# EAGLE design shades_v40 (EAGLE 9.6.2)
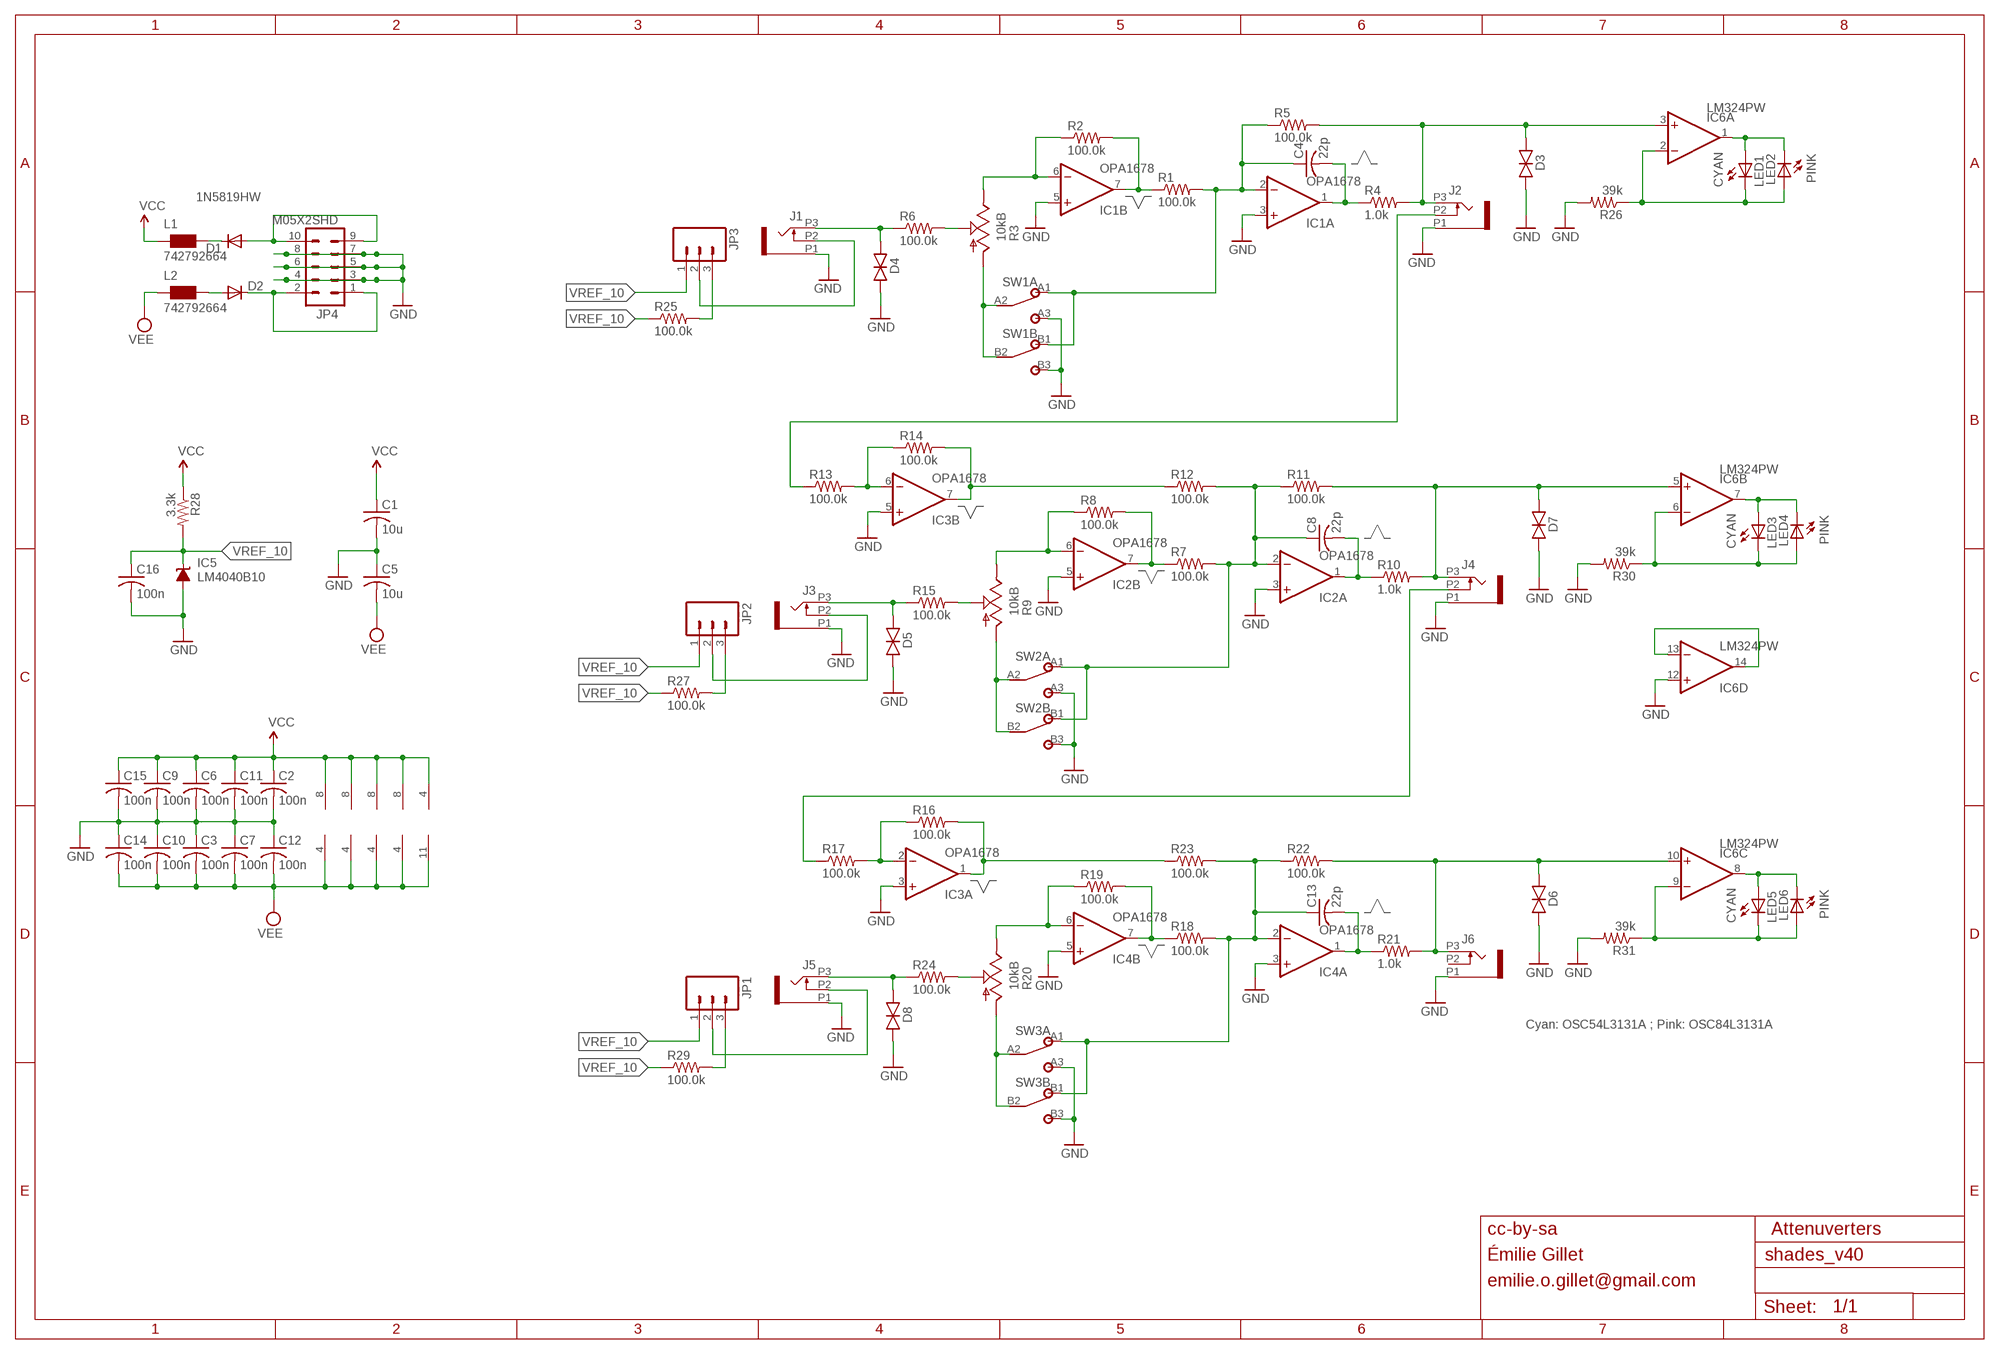
[diagram p0: schematic, sheet 1]

## Parts
C1  10u  C-USC1210  [C1210]
C2  100n  C-USC0402  [C0402]
C3  100n  C-USC0402  [C0402]
C4  22p  C-USC0402  [C0402]
C5  10u  C-USC1210  [C1210]
C6  100n  C-USC0402  [C0402]
C7  100n  C-USC0402  [C0402]
C8  22p  C-USC0402  [C0402]
C9  100n  C-USC0402  [C0402]
C10  100n  C-USC0402  [C0402]
C11  100n  C-USC0402  [C0402]
C12  100n  C-USC0402  [C0402]
C13  22p  C-USC0402  [C0402]
C14  100n  C-USC0402  [C0402]
C15  100n  C-USC0402  [C0402]
C16  100n  C-USC0402  [C0402]
D1  1N5819HW  DIODE-SOD123  [SOD123]
D2  1N5819HW  DIODE-SOD123  [SOD123]
D3  TVS  [0603]
D4  TVS  [0603]
D5  TVS  [0603]
D6  TVS  [0603]
D7  TVS  [0603]
D8  TVS  [0603]
IC1  OPA1678  OPA1678DGK  [VSSOP8]
IC2  OPA1678  OPA1678DGK  [VSSOP8]
IC3  OPA1678  OPA1678DGK  [VSSOP8]
IC4  OPA1678  OPA1678DGK  [VSSOP8]
IC5  LM4040B10  LM4041B12DBZ  [DBZ_R-PDSO-G3]
IC6  LM324PW  TL074PW  [TSSOP14_065]
J1  PJ301_THONKICONNTME  [WQP_PJ_301M_TME]
J2  PJ301_THONKICONNTME  [WQP_PJ_301M_TME]
J3  PJ301_THONKICONNTME  [WQP_PJ_301M_TME]
J4  PJ301_THONKICONNTME  [WQP_PJ_301M_TME]
J5  PJ301_THONKICONNTME  [WQP_PJ_301M_TME]
J6  PJ301_THONKICONNTME  [WQP_PJ_301M_TME]
JP1  M03PTH  [1X03]
JP2  M03PTH  [1X03]
JP3  M03PTH  [1X03]
JP4  M05X2SHD  [2X5-SHROUDED]
L1  742792664  WE-CBF_0603  [0603]
L2  742792664  WE-CBF_0603  [0603]
LED1  CYAN  LED3MM  [LED3MM]
LED2  PINK  LED3MM  [LED3MM]
LED3  CYAN  LED3MM  [LED3MM]
LED4  PINK  LED3MM  [LED3MM]
LED5  CYAN  LED3MM  [LED3MM]
LED6  PINK  LED3MM  [LED3MM]
R1  100.0k  R-US_R0402  [R0402]
R2  100.0k  R-US_R0402  [R0402]
R3  10kB  POT_USVERTICAL_PS  [ALPS_POT_VERTICAL_PS]
R4  1.0k  R-US_R0603  [R0603]
R5  100.0k  R-US_R0402  [R0402]
R6  100.0k  R-US_R0402  [R0402]
R7  100.0k  R-US_R0402  [R0402]
R8  100.0k  R-US_R0402  [R0402]
R9  10kB  POT_USVERTICAL_PS  [ALPS_POT_VERTICAL_PS]
R10  1.0k  R-US_R0603  [R0603]
R11  100.0k  R-US_R0402  [R0402]
R12  100.0k  R-US_R0402  [R0402]
R13  100.0k  R-US_R0402  [R0402]
R14  100.0k  R-US_R0402  [R0402]
R15  100.0k  R-US_R0402  [R0402]
R16  100.0k  R-US_R0402  [R0402]
R17  100.0k  R-US_R0402  [R0402]
R18  100.0k  R-US_R0402  [R0402]
R19  100.0k  R-US_R0402  [R0402]
R20  10kB  POT_USVERTICAL_PS  [ALPS_POT_VERTICAL_PS]
R21  1.0k  R-US_R0603  [R0603]
R22  100.0k  R-US_R0402  [R0402]
R23  100.0k  R-US_R0402  [R0402]
R24  100.0k  R-US_R0402  [R0402]
R25  100.0k  R-US_R0402  [R0402]
R26  39k  R-US_R0402  [R0402]
R27  100.0k  R-US_R0402  [R0402]
R28  3.3k  R-US_R0402  [R0402]
R29  100.0k  R-US_R0402  [R0402]
R30  39k  R-US_R0402  [R0402]
R31  39k  R-US_R0402  [R0402]
SW1  S-ON-ON-ONSS70070F-0202  [SS70070F-0202]
SW2  S-ON-ON-ONSS70070F-0202  [SS70070F-0202]
SW3  S-ON-ON-ONSS70070F-0202  [SS70070F-0202]

## Nets
GND: C1.2 C2.2 C3.1 C5.1 C6.2 C7.1 C9.2 C10.1 C11.2 C12.1 C14.1 C15.2 C16.2 D3.1(A) D4.1(A) D5.1(A) D6.1(A) D7.1(A) D8.1(A) IC1.3(A:+IN) IC1.5(B:+IN) IC2.3(A:+IN) IC2.5(B:+IN) IC3.3(A:+IN) IC3.5(B:+IN) IC4.3(A:+IN) IC4.5(B:+IN) IC5.2(A) IC6.12(D:+IN) J1.P1 J2.P1 J3.P1 J4.P1 J5.P1 J6.P1 JP4.3 JP4.4 JP4.5 JP4.6 JP4.7 JP4.8 R26.2 R30.2 R31.2 SW1.A3 SW1.B3 SW2.A3 SW2.B3 SW3.A3 SW3.B3
N$2: D1.A JP4.9 JP4.10
N$4: IC6.2(A:-IN) LED1.K(C) LED2.A R26.1
N$5: IC6.13(D:-IN) IC6.14(D:OUT)
N$6: IC6.6(B:-IN) LED3.K(C) LED4.A R30.1
N$7: IC6.1(A:OUT) LED1.A LED2.K(C)
N$8: J1.P2 JP3.2
N$9: J3.P2 JP2.2
N$10: R3.P$2(S) R6.2
N$11: R3.P$3(A) SW1.A2 SW1.B2
N$12: C4.1 IC1.2(A:-IN) R1.2 R5.1 SW1.A1 SW1.B1
N$13: IC1.6(B:-IN) R2.1 R3.P$1(E)
N$14: IC1.7(B:OUT) R1.1 R2.2
N$15: C4.2 IC1.1(A:OUT) R4.1
N$16: JP3.3 R25.2
N$17: JP2.3 R27.2
N$18: R9.P$2(S) R15.2
N$19: R9.P$3(A) SW2.A2 SW2.B2
N$20: IC6.7(B:OUT) LED3.A LED4.K(C)
N$21: D2.C JP4.1 JP4.2
N$22: IC2.6(B:-IN) R8.1 R9.P$1(E)
N$23: IC2.7(B:OUT) R7.1 R8.2
N$24: IC6.9(C:-IN) LED5.K(C) LED6.A R31.1
N$25: C8.2 IC2.1(A:OUT) R10.1
N$26: J5.P2 JP1.2
N$27: R20.P$2(S) R24.2
N$28: IC6.8(C:OUT) LED5.A LED6.K(C)
N$29: JP1.3 R29.2
N$30: IC4.6(B:-IN) R19.1 R20.P$1(E)
N$31: IC4.7(B:OUT) R18.1 R19.2
N$33: C13.2 IC4.1(A:OUT) R21.1
N$36: IC3.6(B:-IN) R13.2 R14.1
N$37: IC3.2(A:-IN) R16.1 R17.2
N$38: IC3.1(A:OUT) R16.2 R23.1
N$39: IC3.7(B:OUT) R12.1 R14.2
N$40: C13.1 IC4.2(A:-IN) R18.2 R22.1 R23.2 SW3.A1 SW3.B1
N$41: C8.1 IC2.2(A:-IN) R7.2 R11.1 R12.2 SW2.A1 SW2.B1
N$48: D1.C L1.2
N$50: D2.A L2.2
OUT_1: D3.2(C) IC6.3(A:+IN) J2.P3 R4.2 R5.2
OUT_2: D7.2(C) IC6.5(B:+IN) J4.P3 R10.2 R11.2
OUT_3: D6.2(C) IC6.10(C:+IN) J6.P3 R21.2 R22.2
RAW_IN_1: D4.2(C) J1.P3 R6.1
RAW_IN_2: D5.2(C) J3.P3 R15.1
RAW_IN_3: D8.2(C) J5.P3 R24.1
SEND_1: J2.P2 R13.1
SEND_2: J4.P2 R17.1
SW3: R20.P$3(A) SW3.A2 SW3.B2
VCC: C1.1 C2.1 C6.1 C9.1 C11.1 C15.1 IC1.8(P:V+) IC2.8(P:V+) IC3.8(P:V+) IC4.8(P:V+) IC6.4(P:V+) L1.1 R28.1
VEE: C3.2 C5.2 C7.2 C10.2 C12.2 C14.2 IC1.4(P:V-) IC2.4(P:V-) IC3.4(P:V-) IC4.4(P:V-) IC6.11(P:V-) L2.1
VREF_10: C16.1 IC5.1(C) JP1.1 JP2.1 JP3.1 R25.1 R27.1 R28.2 R29.1
Unconnected: J6.P2

## Notes on the sheet
- Cyan: OSC54L3131A ; Pink: OSC84L3131A
- cc-by-sa | Attenuverters
- Émilie Gillet
- emilie.o.gillet@gmail.com

## Library data of the parts
C1-C16 = rcl:C-US: CAPACITOR, American symbol
D1 D2 = diode:DIODE-: DIODE
D3-D8 = og-diodes:TVS
IC1-IC4 = og-linear:OPA1678
IC5 = texas:LM4041: PRECISION MICROPOWER SHUNT VOLTAGE REFERENCE Source: http://focus.ti.com/lit/ds/slcs146e/slcs146e.pdf
IC6 = og-linear:TL074: OP AMP
J1-J6 = og-pj301:PJ301_THONKICONN
JP1-JP3 = SparkFun:M03: Header 3 Standard 3-pin 0.1" header. Use with straight break away headers (SKU : PRT-00116), right angle break away headers (PRT-00553), swiss pins (PRT-00743), machine pins (PRT-00117), and female headers (PRT-00115). Molex polarized connector foot print use with SKU : PRT-08232 with associated crimp pins and housings.
JP4 = og-header:M05X2: Header 5x2 Standard 10-pin dual row 0.1" header. Commonly used with AVR-ISP. Use with Spark Fun Electronics SKU: PRT-00778
L1 L2 = wuerth-elektronik:WE-CBF: SMD EMI Suppression Ferrite Beads - excellent anti-EMI properties - low DCR - impedances till 3000 ohms - rated current up to 6 A
LED1-LED6 = led:LED: LED OSRAM: - CHIPLED LG R971, LG N971, LY N971, LG Q971, LY Q971, LO R971, LY R971 LH N974, LH R974 LS Q976, LO Q976, LY Q976 LO Q996 - Hyper CHIPLED LW Q18S LB Q993, LB Q99A, LB R99A - SideLED LS A670, LO A670, LY A670, LG A670, LP A670 LB A673, LV A673, LT A673, LW A673 LH A674 LY A675 LS A676, LA A676, LO A676, LY A676, LW A676 LS A679, LY A679, LG A679 - Hyper Micro SIDELED® LS Y876, LA Y876, LO Y876, LY Y876 LT Y87S - SmartLED LW L88C, LW L88S LB L89C, LB L89S, LG L890 LS L89K, LO L89K, LY L89K LS L896, LA L896, LO L896, LY L896 - TOPLED LS T670, LO T670, LY T670, LG T670, LP T670 LSG T670, LSP T670, LSY T670, LOP T670, LYG T670 LG T671, LOG T671, LSG T671 LB T673, LV T673, LT T673, LW T673 LH T674 LS T676, LA T676, LO T676, LY T676, LB T676, LH T676, LSB T676, LW T676 LB T67C, LV T67C, LT T67C, LS T67K, LO T67K, LY T67K, LW E67C LS E67B, LA E67B, LO E67B, LY E67B, LB E67C, LV E67C, LT E67C LW T67C LS T679, LY T679, LG T679 LS T770, LO T770, LY T770, LG T770, LP T770 LB T773, LV T773, LT T773, LW T773 LH T774 LS E675, LA E675, LY E675, LS T675 LS T776, LA T776, LO T776, LY T776, LB T776 LHGB T686 LT T68C, LB T68C - Hyper Mini TOPLED® LB M676 - Mini TOPLED Santana® LG M470 LS M47K, LO M47K, LY M47K Source: http://www.osram.convergy.de LUXEON: - LUMILED® LXK2-PW12-R00, LXK2-PW12-S00, LXK2-PW14-U00, LXK2-PW14-V00 LXK2-PM12-R00, LXK2-PM12-S00, LXK2-PM14-U00 LXK2-PE12-Q00, LXK2-PE12-R00, LXK2-PE12-S00, LXK2-PE14-T00, LXK2-PE14-U00 LXK2-PB12-K00, LXK2-PB12-L00, LXK2-PB12-M00, LXK2-PB14-N00, LXK2-PB14-P00, LXK2-PB14-Q00 LXK2-PR12-L00, LXK2-PR12-M00, LXK2-PR14-Q00, LXK2-PR14-R00 LXK2-PD12-Q00, LXK2-PD12-R00, LXK2-PD12-S00 LXK2-PH12-R00, LXK2-PH12-S00 LXK2-PL12-P00, LXK2-PL12-Q00, LXK2-PL12-R00 Source: www.luxeon.com KINGBRIGHT: KA-3528ASYC Source: www.kingbright.com
R1 R2 R4-R8 R10-R19 R21-R27 R29-R31 = rcl:R-US_: RESISTOR, American symbol
R3 R9 R20 = pot-alps:POT_US
R28 = resistor:R-US_: RESISTOR, American symbol
SW1-SW3 = og-switch:S-ON-ON-ON

## Board
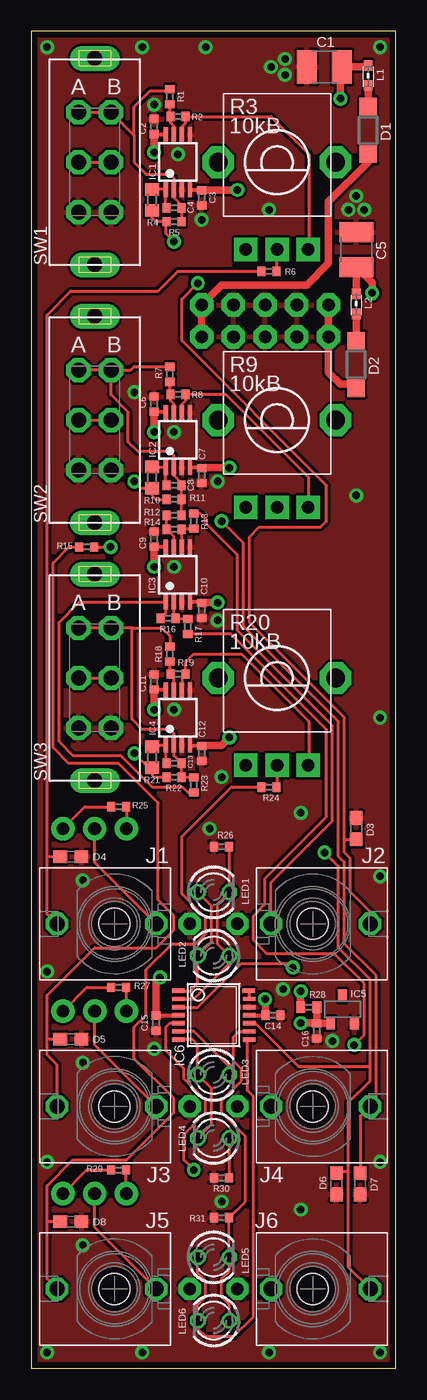
[diagram p1: board, top side]
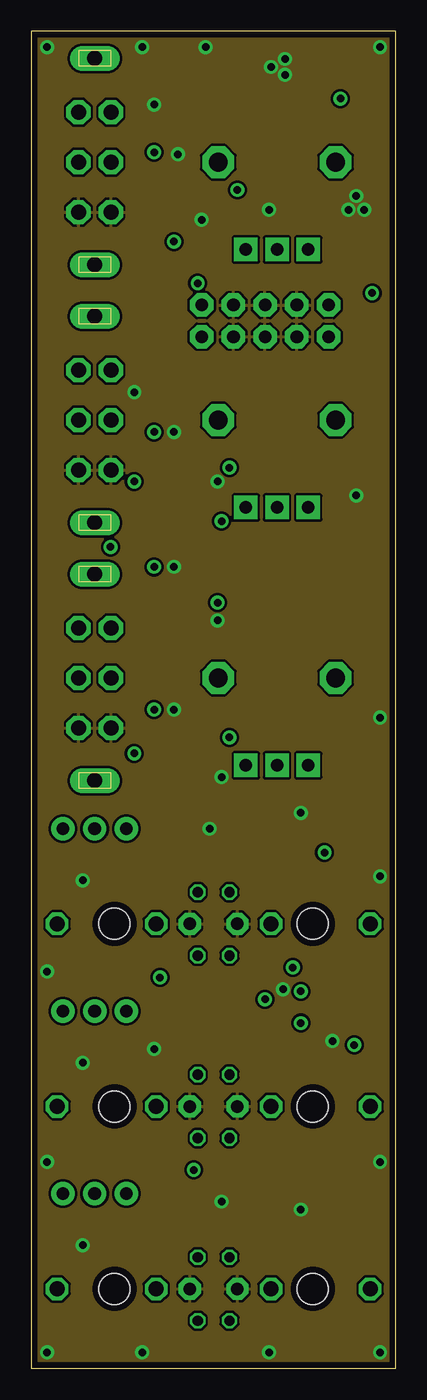
[diagram p2: board, inner layer InternalGround]
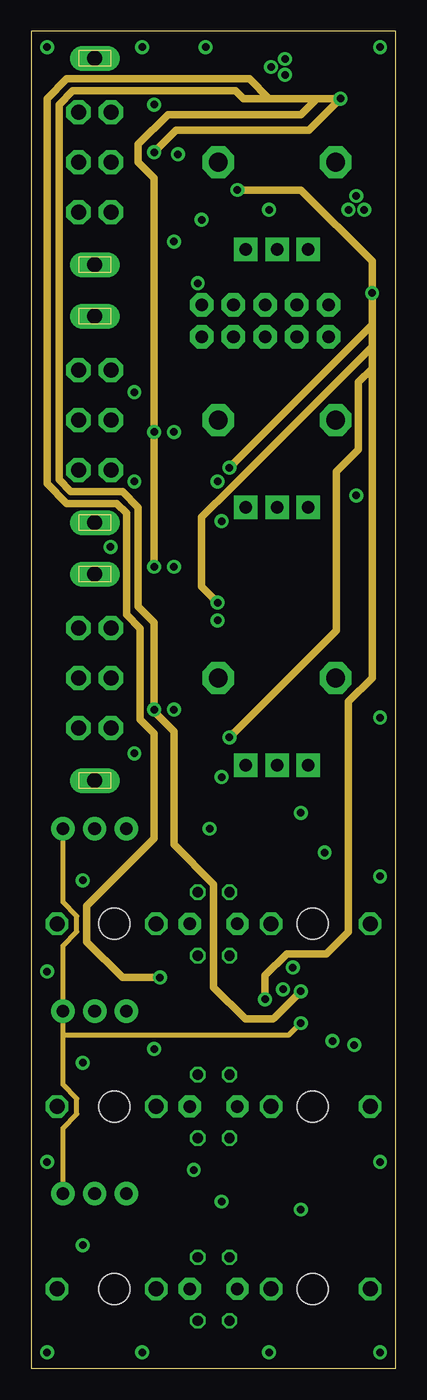
[diagram p3: board, inner layer Supplies]
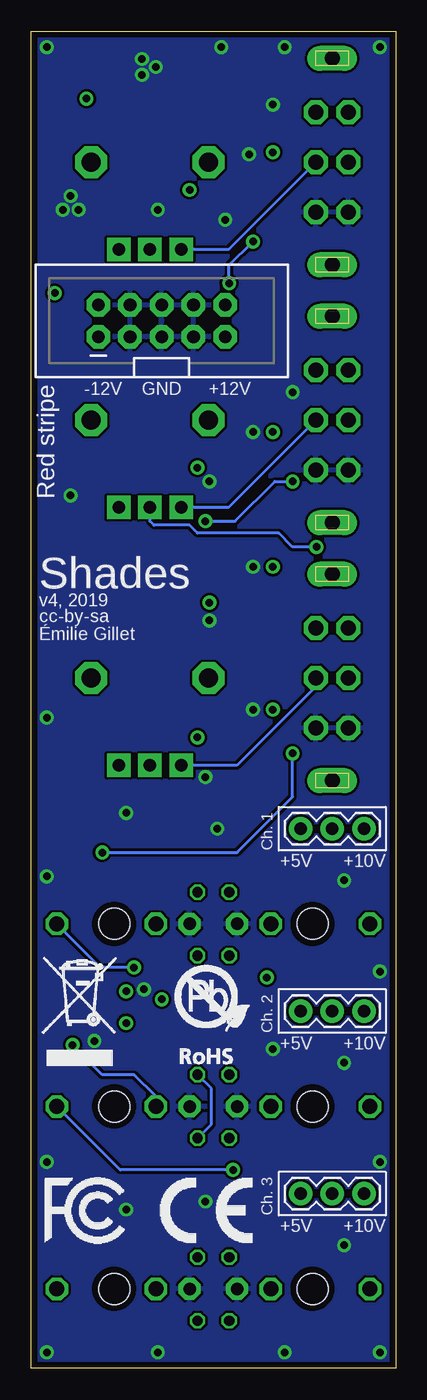
[diagram p4: board, bottom side, seen from below]

Size 29.19 x 107 mm. Coordinates in mm from the lower left corner, seen from the top.
Outline: 0,0 29.19,0 29.19,107 0,107 0,0
Copper layers (1+2*15+16): Top 0.05mm / dielectric 0.3mm / InternalGround 0.05mm / dielectric 0.75mm / Supplies 0.035mm / dielectric 0.2mm / Bottom 0.05mm
Design rules "PCBCart-Standard-4L": minimum track width 8mil, minimum drill 0.3mm, track to track 8mil, track to pad 8mil, pad to pad 8mil, via to via 8mil, smd to smd 8mil, copper to edge 20mil, drill to drill 8mil, minimum pad ring 8mil, minimum via ring 10mil, stop-mask expansion 3mil, vias tented up to drill 25mil, thermal gap 8mil

### Footprints (pad centres in the part's own frame; a part is rotated, then mirrored left to right if it is on the bottom)
C1210 = smd 1.6 x 2.7: 1 -1.4,0; 2 1.4,0
C0402 = smd 0.65 x 0.75: 1 -0.6,0; 2 0.6,0
SOD123 = smd 1.4 x 1.4: A 1.9,0; C -1.9,0
0603 = smd 1.1 x 1: 1 -0.85,0; 2 0.85,0
VSSOP8 = smd 0.35 x 1.2: 1 -0.975,-2.2; 2 -0.325,-2.2; 3 0.325,-2.2; 4 0.975,-2.2; 5 0.975,2.2; 6 0.325,2.2; 7 -0.325,2.2; 8 -0.975,2.2
DBZ_R-PDSO-G3 = smd 0.7 x 1: 1 -0.95,-1.1; 2 0.95,-1.1; 3 0,1.1
TSSOP14_065 = smd 0.35 x 1: 1 -1.95,-2.845; 2 -1.3,-2.845; 3 -0.65,-2.845; 4 0,-2.845; 5 0.65,-2.845; 6 1.3,-2.845; 7 1.95,-2.845; 8 1.95,2.845; 9 1.3,2.845; 10 0.65,2.845; 11 0,2.845; 12 -0.65,2.845; 13 -1.3,2.845; 14 -1.95,2.825
WQP_PJ_301M_TME = drill 1 pad 1.778 octagon: P1 0,-6.032 | drill 1.2 pad 1.778 octagon: P2 0,-3.334; P3 0,4.604 | hole 2.5: 0,0
1X03 = drill 1.016 pad 1.88: 1 0,0; 2 2.54,0; 3 5.08,0
2X5-SHROUDED = drill 1.016 pad 1.88 octagon: 1 -1.27,5.08; 2 1.27,5.08; 3 -1.27,2.54; 4 1.27,2.54; 5 -1.27,0; 6 1.27,0; 7 -1.27,-2.54; 8 1.27,-2.54; 9 -1.27,-5.08; 10 1.27,-5.08
0603' = smd 0.85 x 0.7: 1 -0.9,0; 2 0.7,0
LED3MM = drill 0.813 octagon: A -1.27,0; K 1.27,0
R0402 = smd 0.65 x 0.75: 1 -0.6,0; 2 0.6,0
ALPS_POT_VERTICAL_PS = drill 1 pad 1.88 square: P$1 -2.5,7; P$2 0,7; P$3 2.5,7 | drill 1.5 pad 2.54 octagon: P$4 -4.7,0; P$5 4.7,0
R0603 = smd 1 x 1.1: 1 -0.85,0; 2 0.85,0
R0402' = smd 0.7 x 0.9: 1 -0.65,0; 2 0.65,0
SS70070F-0202 = drill 1.2 pad 1.93 octagon: A1 -1.3,4; A2 -1.3,0; A3 -1.3,-4; B1 1.3,4; B2 1.3,0; B3 1.3,-4 | drill 1.2 pad 2 long: P$1 0,-8.21; P$4 0,8.3

### Placement (x,y rotation side)
C1  23.5,104.14 180 top
C2  9.84,99.38 90 top
C3  13.65,93.66 90 top
C4  11.43,92.87 180 top
C5  26.04,89.53 270 top
C6  9.84,77.15 90 top
C7  13.65,71.44 90 top
C8  11.43,70.64 180 top
C9  9.84,66.36 90 top
C10  13.65,60.64 90 top
C11  9.84,54.93 90 top
C12  13.65,49.21 90 top
C13  11.43,48.42 180 top
C14  19.37,28.26 180 top
C15  10,27.62 270 top
C16  22.86,26.99 270 top
D1  26.99,99.06 270 top
D2  26.04,80.33 90 top
D3  26.04,43.18 270 top
D4  3.18,40.96 180 top
D5  3.18,26.35 180 top
D6  24.45,14.76 90 top
D7  26.35,14.76 90 top
D8  3.17,11.75 180 top
IC1  11.75,96.52 0 top
IC2  11.75,74.3 0 top
IC3  11.75,63.5 0 top
IC4  11.75,52.07 0 top
IC5  24.92,28.73 0 top
IC6  14.61,28.26 270 top
J1  6.67,35.56 90 top
J2  22.54,35.56 270 top
J3  6.67,20.95 90 top
J4  22.54,20.95 270 top
J5  6.67,6.35 90 top
J6  22.54,6.35 270 top
JP1  2.54,13.97 180 bottom
JP2  2.54,28.57 180 bottom
JP3  2.54,43.18 180 bottom
JP4  18.73,83.82 90 bottom
L1  742792664  [0603']  26.99,103.35 270 top
L2  742792664  [0603']  26.04,85.09 270 top
LED1  14.61,38.1 0 top
LED2  14.61,33.02 180 top
LED3  14.6,23.5 0 top
LED4  14.61,18.41 180 top
LED5  14.61,8.89 0 top
LED6  14.6,3.81 180 top
R1  11.11,101.76 90 top
R2  11.75,100.17 180 top
R3  19.68,96.52 180 top
R4  9.68,93.5 270 top
R5  11.43,91.76 180 top
R6  19.05,87.79 0 top
R7  11.11,79.53 90 top
R8  11.75,77.95 180 top
R9  19.68,75.88 180 top
R10  9.68,71.28 270 top
R11  11.43,69.53 180 top
R12  11.43,68.26 0 top
R13  13.02,67.79 270 top
R14  11.43,67.15 180 top
R15  4.45,65.72 0 top
R16  10.95,60.01 180 top
R17  12.54,59.37 90 top
R18  11.11,57.15 90 top
R19  11.75,55.56 180 top
R20  19.68,55.24 180 top
R21  9.68,48.89 270 top
R22  11.43,47.31 180 top
R23  13.02,46.67 90 top
R24  19.05,46.51 0 top
R25  6.99,44.93 0 top
R26  15.24,41.75 180 top
R27  6.99,30.48 0 top
R28  3.3k  [R0402']  22.23,28.89 0 top
R29  6.99,15.88 0 top
R30  15.24,15.24 180 top
R31  15.24,12.06 180 top
SW1  5.08,96.52 0 top
SW2  5.08,75.88 0 top
SW3  5.08,55.24 0 top
U$1  [CE_MEDIUM]  18.89,10 0 bottom
U$2  [FCC_MEDIUM]  28.1,10 0 bottom
U$3  [TRASHCAN_LOGO]  28.1,23.97 0 bottom
U$4  [ROHS_LOGO]  17.3,24.29 0 bottom

### Tracks (layer width: path | path; a pad name or v marks a point on that pad's centre or on a via)
GND  (via drill 0.6)
  other vias: 9.84,101.12 13.65,91.92 11.75,97.16 8.26,78.11 14.92,70.96 15.24,47.31 11.43,64.14 11.43,52.71 11.43,74.93 9.84,25.56 20.16,30.32 24.13,26.19 20.32,104.78 20.32,103.5 19.21,104.14 25.4,92.71 26.67,92.71 26.04,93.82 14.92,59.85 4.13,24.45 1.27,1.27 27.94,1.27 1.27,105.73 27.94,105.73 8.89,1.27 19.05,1.27 1.27,16.51 27.94,16.51 1.27,31.75 27.94,39.37 27.94,52.07 21.59,44.45 26.04,69.85 19.05,92.71 8.89,105.73 13.97,105.73 15.24,13.34 14.29,43.18 4.13,9.84 4.13,39.05 21.59,12.7
  pour Bottom: 0,107 0,0 29.21,0 29.21,107
  pour Top: 0,107 0,0 29.21,0 29.21,107
  pour InternalGround: 0,107 29.21,107 29.21,0 0,0
N$2
  Top 0.61: JP4.9 JP4.10 15.24,86.68 22.07,86.68 23.81,88.42 23.81,93.34 26.99,96.52 D1.A
N$4
  Top 0.254: LED2.A | LED2.A 15.88,32.38 13.05,29.56 IC6.2 | R26.1 15.88,41.72 LED1.K 14.92,37.15 14.92,33.97 LED2.A | LED2.A
N$5
  Top 0.254: IC6.13 17.43,29.58 IC6.14
N$6
  Top 0.254: IC6.6 13.05,26.96 15.88,24.13 LED3.K | R30.1 15.88,15.28 LED4.A | LED4.A
  Bottom 0.254: LED4.A 14.76,19.53 14.76,22.38 LED3.K | LED3.K
N$7
  Top 0.254: IC6.1 12.74,30.21 13.34,30.8 LED2.K | LED1.A 14.45,36.99 14.45,34.13 LED2.K | LED2.K
N$8
  Top 0.254: J1.P2 5.08,40.48 JP3.2
N$9
  Top 0.254: J3.P2 5.08,25.88 JP2.2
N$10
  Top 0.254: R6.2 19.68,87.82 R3.P$2
N$11
  Top 0.254: SW1.A2 SW1.B2
  Bottom 0.254: SW1.B2 13.38,89.52 R3.P$3
N$12
  Top 0.254: SW1.A1 SW1.B1 8.26,98.64 | 8.26,98.64 8.26,98.42 8.26,96.52 9.21,95.57 11.11,95.57 11.42,95.26 IC1.2 11.43,93.66 12.03,93.06 C4.1 R5.1 | R1.2 10.99,102.23 9.53,102.23 8.26,100.97 8.26,98.64
N$13
  Top 0.254: R3.P$1 22.23,89.56 22.23,97.16 19.21,100.17 R2.1 12.35,99.66 12.06,99.38 IC1.6
N$14
  Top 0.254: IC1.7 11.43,99.38 11.15,99.66 R2.2 11.11,100.21 R1.1
N$15
  Top 0.254: C4.2 10.77,92.93 IC1.1 10.74,94.35 R4.1
N$16
  Top 0.254: R25.2 7.62,44.89 JP3.3
N$17
  Top 0.254: JP2.3 7.58,28.61 R27.2
N$18  (via drill 0.6)
  Top 0.254: R15.2 v6.35,65.72
  Bottom 0.254: v6.35,65.72 8.26,65.72 9.37,66.83 15.88,66.83 16.51,67.47 19.37,67.47 19.68,67.79 R9.P$2
N$19
  Top 0.254: SW2.A2 SW2.B2
  Bottom 0.254: SW2.B2 13.38,68.88 R9.P$3
N$20
  Top 0.254: LED3.A | LED3.A 13.34,25.88 12.9,26.31 IC6.7 | LED3.A | LED3.A 14.45,22.38 14.45,19.53 LED4.K | LED4.K
N$21
  Top 0.61: JP4.2 JP4.1 23.81,79.69 24.77,78.74 25.72,78.74 D2.C
N$22
  Top 0.254: IC2.6 12.06,77.15 12.35,77.44 R8.1 15.56,77.95 22.18,71.32 R9.P$1
N$23
  Top 0.254: IC2.7 11.43,77.15 11.15,77.44 R8.2 11.11,77.98 R7.1
N$24
  Top 0.254: 17.42,26.99 IC6.9 16.64,26.96 16.19,26.51 16.19,24.61 16.83,23.97 16.83,23.02 15.24,21.43 15.24,20.48 17.14,18.57 17.14,13.34 15.88,12.06 R31.1 15.84,9.28 15.88,9.24 LED5.K 15.88,7.78 15.24,7.14 15.24,5.71 15.88,5.08 LED6.A
N$25
  Top 0.254: R10.1 9.72,72.09 IC2.1 10.77,70.7 C8.2
N$26
  Top 0.254: J5.P2 5.08,11.27 JP1.2
N$27
  Top 0.254: R24.2 19.68,46.55 R20.P$2
N$28
  Top 0.254: IC6.8 17.3,26.16 17.3,22.23 17.78,21.75 17.78,7.3 17.78,6.99 17.78,4.13 16.19,2.54 13.97,2.54 13.34,3.17 LED6.K 13.34,5.08 13.97,5.71 13.97,6.99 13.34,7.62 LED5.A
N$29
  Top 0.254: JP1.3 7.58,14.01 R29.2
N$30
  Top 0.254: IC4.6 12.07,55.29 R19.1 12.35,56.48 13.02,57.15 16.83,57.15 22.23,51.75 22.23,48.28 R20.P$1
N$31
  Top 0.254: R18.1 11.11,55.6 R19.2 11.42,55.29 IC4.7
N$33
  Top 0.254: C13.2 10.77,48.48 IC4.1 9.81,49.87 R21.1
N$36
  Top 0.254: 12.07,67.11 R14.1 | IC3.6 12.07,67.11 | 12.07,67.11 12.15,67.19 R13.2
N$37
  Top 0.254: IC3.2 11.42,60.14 R16.1 11.59,59.97 R17.2
N$38
  Top 0.254: R16.2 10.77,60.43 IC3.1 3.83,61.3 2.22,59.69 2.22,50.16 3.33,49.05 7.14,49.05 9.68,46.51 12.13,46.51 12.58,46.07 R23.1
N$39
  Top 0.254: R12.1 R14.2 11.42,66.56 IC3.7
N$40
  Top 0.254: R23.2 12.98,47.31 R22.1 12.06,47.34 12.06,47.47 12.03,47.5 C13.1 11.42,49.03 IC4.2 11.42,50.81 11.11,51.12 8.89,51.12 8.06,51.95 8.1,51.98 8.1,59.24 | SW3.A1 SW3.B1 8.1,59.24 | R18.2 11.11,58.58 10.45,59.24 8.1,59.24
N$41
  Top 0.254: SW2.B1 5.71,79.88 | 5.71,79.88 SW2.A1 | R12.2 R11.1 C8.1 12.03,70.84 11.43,71.44 11.43,72.09 IC2.2 11.42,73.03 11.11,73.34 8.57,73.34 7.78,74.14 7.78,76.52 6.38,77.92 SW2.B1 | R7.2 11.08,80.17 8.26,80.17 7.97,79.88 SW2.B1 | SW2.B1 5.71,79.88
N$48
  Top 0.61: D1.C L1.2
N$50
  Top 0.61: D2.A L2.2
OUT_1  (via drill 0.6)
  Top 0.254: R4.2 | R4.2 9.68,92.08 10,91.76 R5.2 10.79,91.72 10.79,90.81 v11.43,90.17 | IC6.3 11.78,28.89 13.34,28.89 16.83,32.38 20.64,32.38 v20.95,32.07 | v13.34,86.84 12.06,85.57 12.06,82.23 23.65,70.64 23.65,67.79 23.18,67.31 18.26,67.31 17.46,66.52 17.46,59.69 25.08,52.07 25.08,42.33 | 25.08,42.33 25.08,41.27 25.56,40.8 25.56,38.1 27.15,36.51 J2.P3 | 25.08,42.33 D3.2
  Bottom 0.254: v20.95,32.07 23.65,32.07 26.99,35.4 J2.P3 | v11.43,90.17 13.34,88.27 v13.34,86.84
OUT_2  (via drill 0.6)
  Top 0.254: R10.2 | R10.2 9.68,69.85 10,69.53 R11.2 | v15.24,67.79 16.99,66.04 16.99,59.37 24.61,51.75 24.61,40.96 25.08,40.48 25.08,33.97 27.62,31.43 27.62,21.43 J4.P3 | v8.26,70.96 8.79,70.43 R10.2 | IC6.5 11.74,27.62 11.11,27.62 10.79,27.3 10.79,25.4 12.22,23.97 12.22,23.18 13.97,21.43 13.97,20.48 12.22,18.73 12.22,16.67 v13.02,15.88 | v13.02,15.88 | D7.2 26.35,20.16 J4.P3 | J4.P3 | J4.P3
  Bottom 0.254: v13.02,15.88 22.07,15.88 J4.P3 | v15.24,67.79 12.86,67.79 9.68,70.96 v8.26,70.96 | J4.P3
OUT_3  (via drill 0.6)
  Top 0.254: R22.2 9.84,47.31 9.68,47.47 R21.2 9.42,48.05 v8.26,49.21 | 25.4,15.72 25.4,21.27 27.15,23.02 27.15,24.13 | 27.15,24.13 27.15,31.11 24.61,33.66 24.61,40.16 24.13,40.64 v23.5,41.27 | 27.15,24.13 21.43,24.13 17.95,27.61 IC6.10 | D6.2 24.55,15.72 25.4,15.72 | J6.P3 25.4,8.1 25.4,15.72
  Bottom 0.254: v8.26,49.21 8.26,45.72 12.7,41.27 v23.5,41.27
RAW_IN_1
  Top 0.254: 1.27,40.96 1.27,84.3 3.17,86.2 10.16,86.2 11.75,87.79 R6.1 | 1.27,40.96 D4.2 | J1.P3 1.27,36.35 1.27,40.96
RAW_IN_2
  Top 0.254: 1.27,26.35 1.27,25.08 2.06,24.29 J3.P3 | 1.27,26.35 1.27,29.84 5.08,33.66 10,33.66 11.43,35.08 11.43,36.2 10.16,37.47 10.16,45.24 6.99,48.42 3.02,48.42 1.75,49.69 1.75,64.45 3.02,65.72 R15.1 | 1.27,26.35 D5.2
RAW_IN_3
  Top 0.254: 1.27,11.75 1.27,14.61 3.33,16.67 7.62,16.67 11.43,20.48 11.43,21.59 8.26,24.77 8.26,27.3 9.21,28.26 9.21,31.91 11.27,33.97 13.18,33.97 13.97,34.77 13.97,36.04 12.06,37.94 12.06,42.55 16.03,46.51 R24.1 | D8.2 | 1.27,11.75 D8.2 | J5.P3 1.27,7.14 1.27,11.75
SEND_1
  Top 0.254: R13.1 13.53,68.39 13.97,67.94 13.97,67.63 16.51,65.09 16.51,59.05 24.13,51.44 24.13,43.81 19.21,38.89 J2.P2
SEND_2  (via drill 0.6)
  Top 0.254: R17.1 16,58.77 23.65,51.12 23.65,44.13 18.73,39.21 18.73,37.15 17.78,36.2 17.78,34.29 18.89,33.18 24.29,33.18 26.67,30.8 26.67,26.67 v25.88,25.88
  Bottom 0.254: v25.88,25.88 23.5,23.5 20.95,23.5 19.21,21.75 J4.P2
SW3
  Top 0.254: SW3.A2 SW3.B2
  Bottom 0.254: SW3.B2 6.35,55.24 6.35,54.61 12.71,48.24 R20.P$3
VCC  (via drill 0.6)
  Top 0.305: IC1.8 10.71,98.78 C2.1 | IC2.8 10.71,76.55 C6.1 | IC3.8 10.71,65.76 C9.1 | IC4.8 10.71,54.33 C11.1 | C15.1 10.04,28.26 IC6.4
  Top 0.61: L1.1 26.88,104.14 C1.1 24.77,104.01 v24.77,101.6 | v9.84,97.31 C2.1 | v9.84,74.93 C6.1 | v9.84,64.14 C9.1 | C11.1 v9.84,52.7 | v21.59,30.16 21.57,30.15 R28.1 | C15.1 10,30.96 v10.32,31.27
  Supplies 0.61: v9.84,64.14 v9.84,74.93 9.84,95.25 8.57,96.52 8.57,97.95 10.95,100.33 21.59,100.33 22.86,101.6 | v21.59,30.16 19.53,28.1 19.37,27.94 17.14,27.94 14.61,30.48 14.61,38.73 11.43,41.91 11.43,50.96 9.84,52.55 v9.84,52.7 9.84,59.69 8.57,60.96 8.57,68.9 7.3,70.17 3.17,70.17 2.22,71.12 2.22,101.12 3.33,102.23 | v10.32,31.27 7.3,31.27 4.45,34.13 4.45,36.99 9.84,42.39 9.84,50.8 8.73,51.91 8.73,59.21 7.62,60.33 7.62,68.42 6.83,69.22 2.86,69.22 1.27,70.8 1.27,101.6 2.86,103.19 17.46,103.19 19.05,101.6 | v9.84,97.31 11.59,99.06 22.23,99.06 v24.77,101.6 22.86,101.6 | 3.33,102.23 | 3.33,102.23 16.35,102.23 16.99,101.6 19.05,101.6 | 19.05,101.6 22.86,101.6
VEE  (via drill 0.6)
  Top 0.305: C14.2 IC6.11 | IC1.4 12.78,94.26 C3.2 | C7.2 13.6,72.09 IC2.4 | C10.2 13.6,61.3 IC3.4 | 13.69,49.85 C12.2 12.78,49.81 IC4.4
  Top 0.61: L2.1 | L2.1 C5.2 27.3,86.86 v27.3,86.04 | v18.73,29.53 18.77,29.49 C14.2 | C3.2 13.69,94.3 v16.51,94.3 | C7.2 13.69,72.07 v15.88,72.07 | 13.6,61.3 13.62,61.28 v14.92,61.28 | v15.88,50.48 15.24,49.85 13.69,49.85
  Supplies 0.61: v16.51,94.3 21.59,94.3 27.3,88.58 v27.3,86.04 27.3,83.5 | v15.88,72.07 | 27.3,81.76 27.3,83.5 | v15.88,50.48 24.45,59.05 24.45,71.75 26.19,73.5 26.19,78.9 27.3,80.01 | 27.3,80.01 27.3,81.76 | 27.3,80.01 27.3,55.24 25.4,53.34 25.4,34.92 23.65,33.18 20.48,33.18 18.73,31.43 v18.73,29.53 | 27.3,83.5 v15.88,72.07 | 27.3,81.76 16.03,70.48 | 16.03,70.48 | 16.03,70.48 13.65,68.1 13.65,62.55 v14.92,61.28
VREF_10  (via drill 0.6)
  Top 0.254: JP3.1 4.29,44.93 R25.1 | R27.1 | R27.1 4.45,30.48 JP2.1 | JP2.1 | JP1.1 4.45,15.88 R29.1
  Top 0.61: R28.2 22.86,28.88 C16.1 | C16.1 22.82,27.62 v21.59,27.62 | IC5.1 23.93,27.59 C16.1
  Supplies 0.406: v21.59,27.62 20.64,26.67 2.54,26.67 | JP3.1 2.54,37.31 3.65,36.2 3.65,34.92 2.54,33.81 JP2.1 | JP1.1 2.54,19.21 3.65,20.32 3.65,21.59 2.54,22.7 2.54,26.67 | JP2.1 | 2.54,26.67 JP2.1

### Text on the board
bPlace: Red stripe | +10V | +5V | Ch. 1 | +10V | +5V | Ch. 2 | +10V | +5V | Ch. 3
bNames: +12V | GND | -12V | Shades | v4, 2019 | cc-by-sa | Émilie Gillet
tStop: Shades | v4, 2019 | cc-by-sa | Émilie Gillet